# EAGLE design shield (EAGLE 6.6.0)
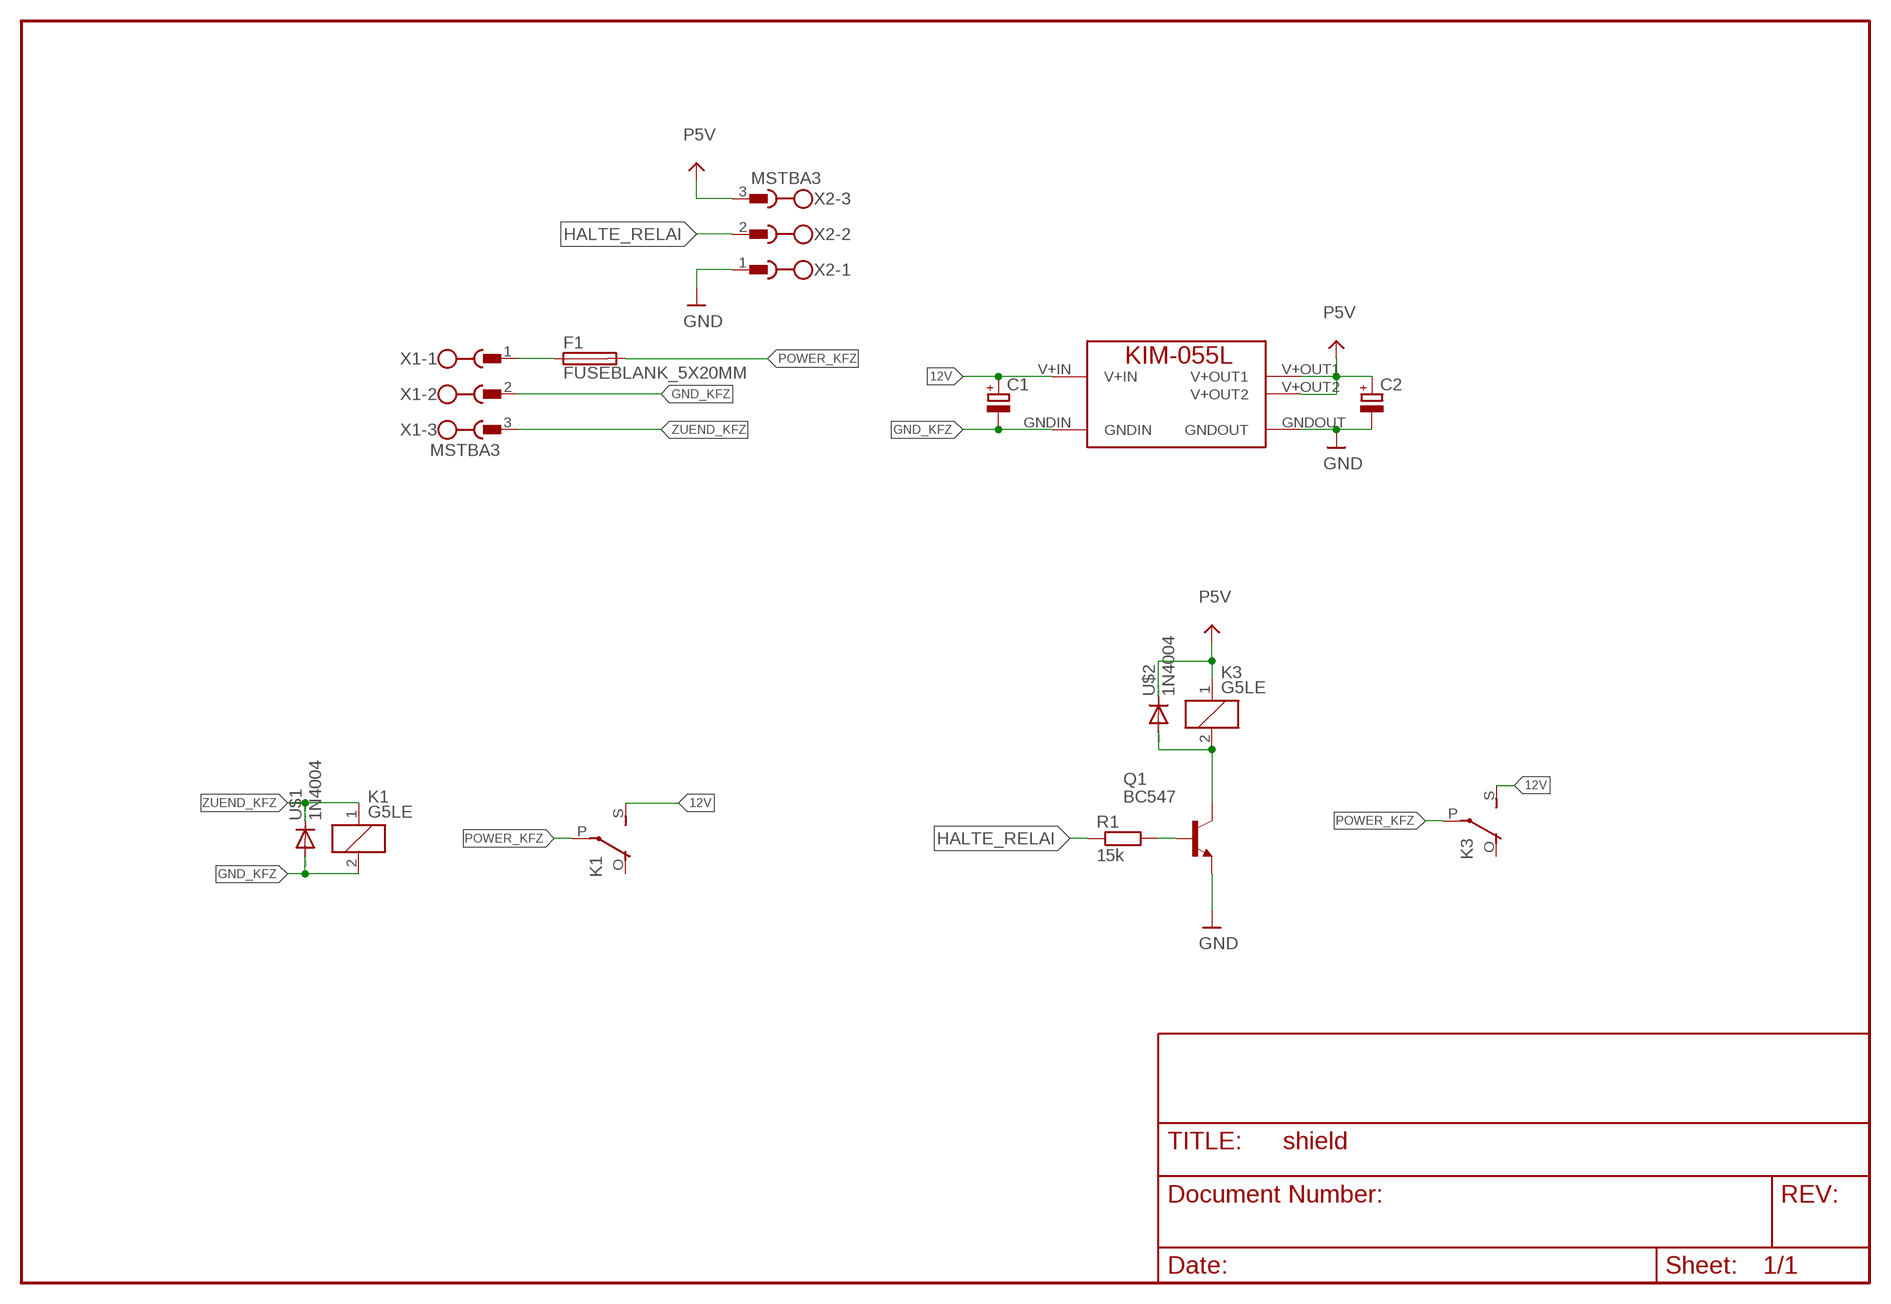
[diagram p0: schematic, sheet 1]

## Parts
C1  CPOL-EUE5-13  [E5-13]
C2  CPOL-EUE5-13  [E5-13]
F1  FUSEBLANK_5X20MM  [FUSE_HOLDER_5X20MM]
K1  G5LE  [G5LE]
K3  G5LE  [G5LE]
MOD1  KIM-055L  [KIM-055L]
Q1  BC547  [TO92]
R1  15k  R-EU_0207/7  [0207/7]
U$1  1N4004  [DO41-10]
U$2  1N4004  [DO41-10]
X1  MSTBA3  [MSTBA3]
X2  MSTBA3  [MSTBA3]

## Nets
12V: C1.+ K1.S(2:S) K3.S(2:S) MOD1.V+IN
GND: C2.- MOD1.GNDOUT Q1.1(E) X2.1
GND_KFZ: C1.- K1.2 MOD1.GNDIN U$1.A X1.2
HALTE_RELAI: R1.1 X2.2
N$1: K3.2 Q1.3(C) U$2.A
N$2: Q1.2(B) R1.2
N$3: F1.1 X1.1
P5V: C2.+ K3.1 MOD1.V+OUT1 MOD1.V+OUT2 U$2.C X2.3
POWER_KFZ: F1.2 K1.P(2:P) K3.P(2:P)
ZUEND_KFZ: K1.1 U$1.C X1.3
Unconnected: K1.O(2:O) K3.O(2:O)

## Library data of the parts
C1 C2 = schlager_passiv:CPOL-EU: POLARIZED CAPACITOR, European symbol
F1 = fuse:FUSE: Fuse; OC_FARNELL: unknown; OC_NEWARK: unknown
K1 K3 = relay:G5LE: RELAY 1 x switch, 10 A/120 V AC, 8 A/30 V DC, Omron; OC_FARNELL: unknown; OC_NEWARK: unknown
MOD1 = kim055l:KIM-055L: 5V 5amp DC DC module. IMPORANT: Add low ESR input & output capacitors. V+OUT1 & V+OUT2 internally connected.
Q1 = transistor-npn:BC547*: NPN Transistor
R1 = schlager_passiv:R-EU_: RESISTOR, European symbol
U$1 U$2 = diode:1N4004: DIODE general purpose rectifier, 1 A
X1 X2 = X_Phoenix:MSTBA3: PHOENIX

## Board
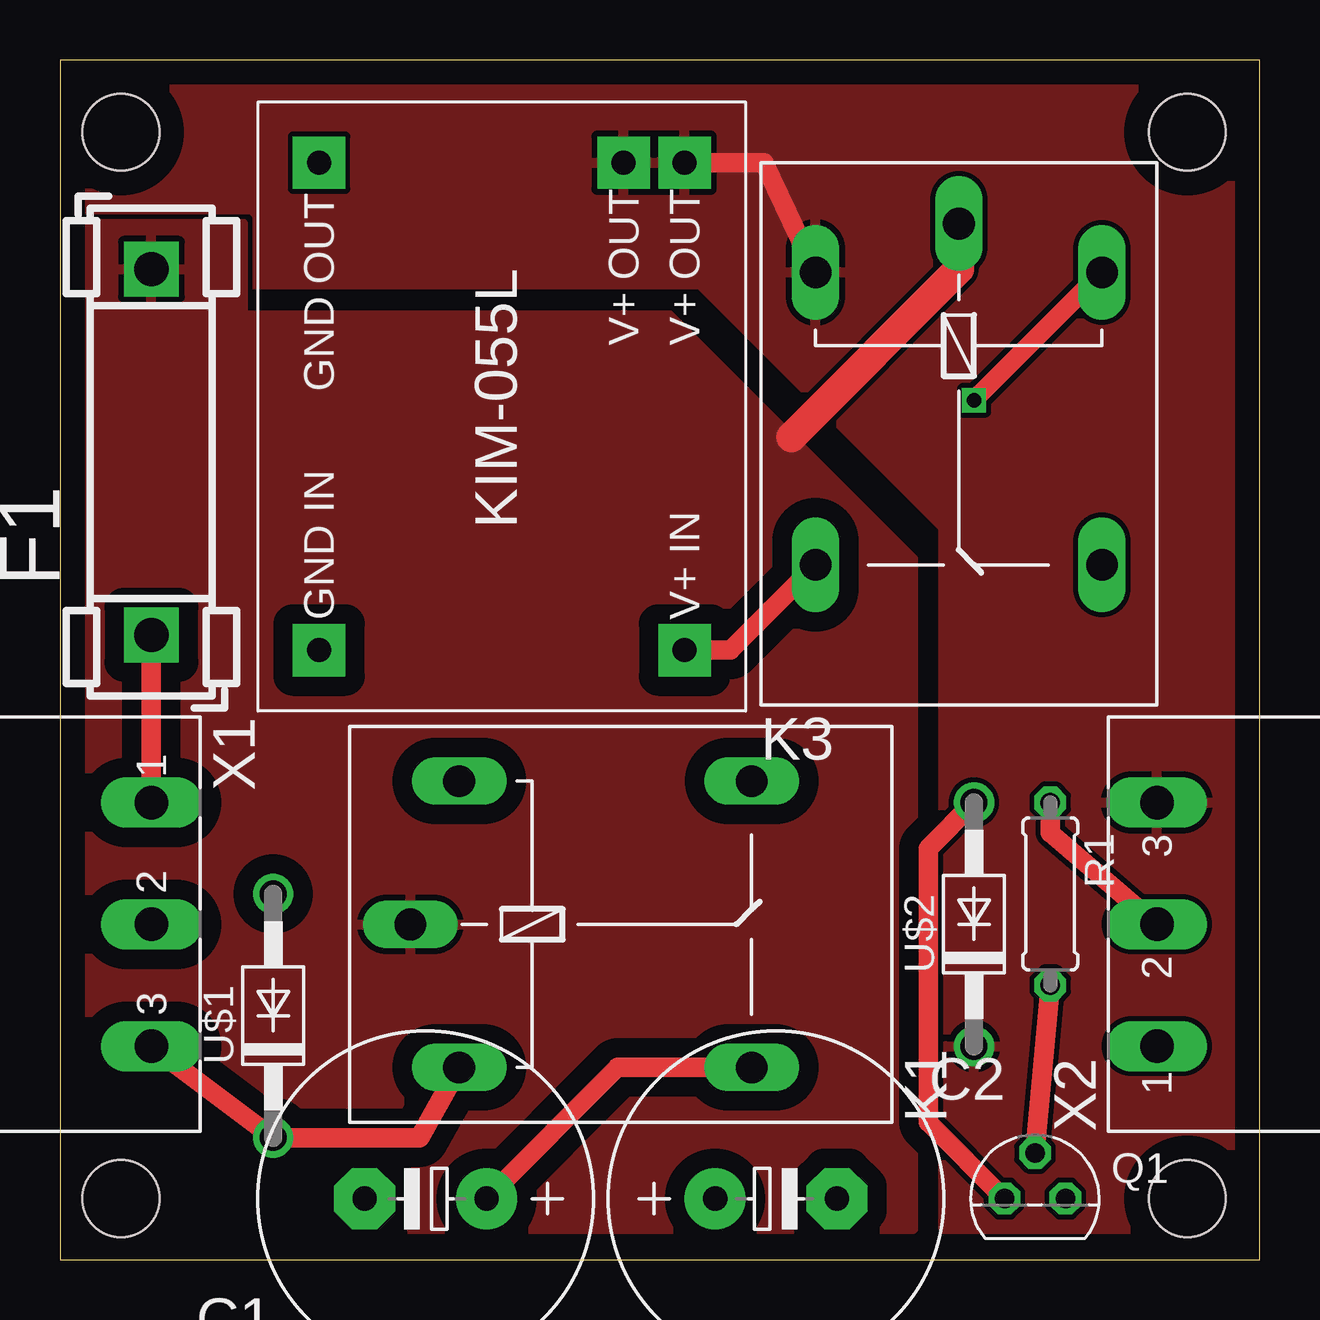
[diagram p1: board, top side]
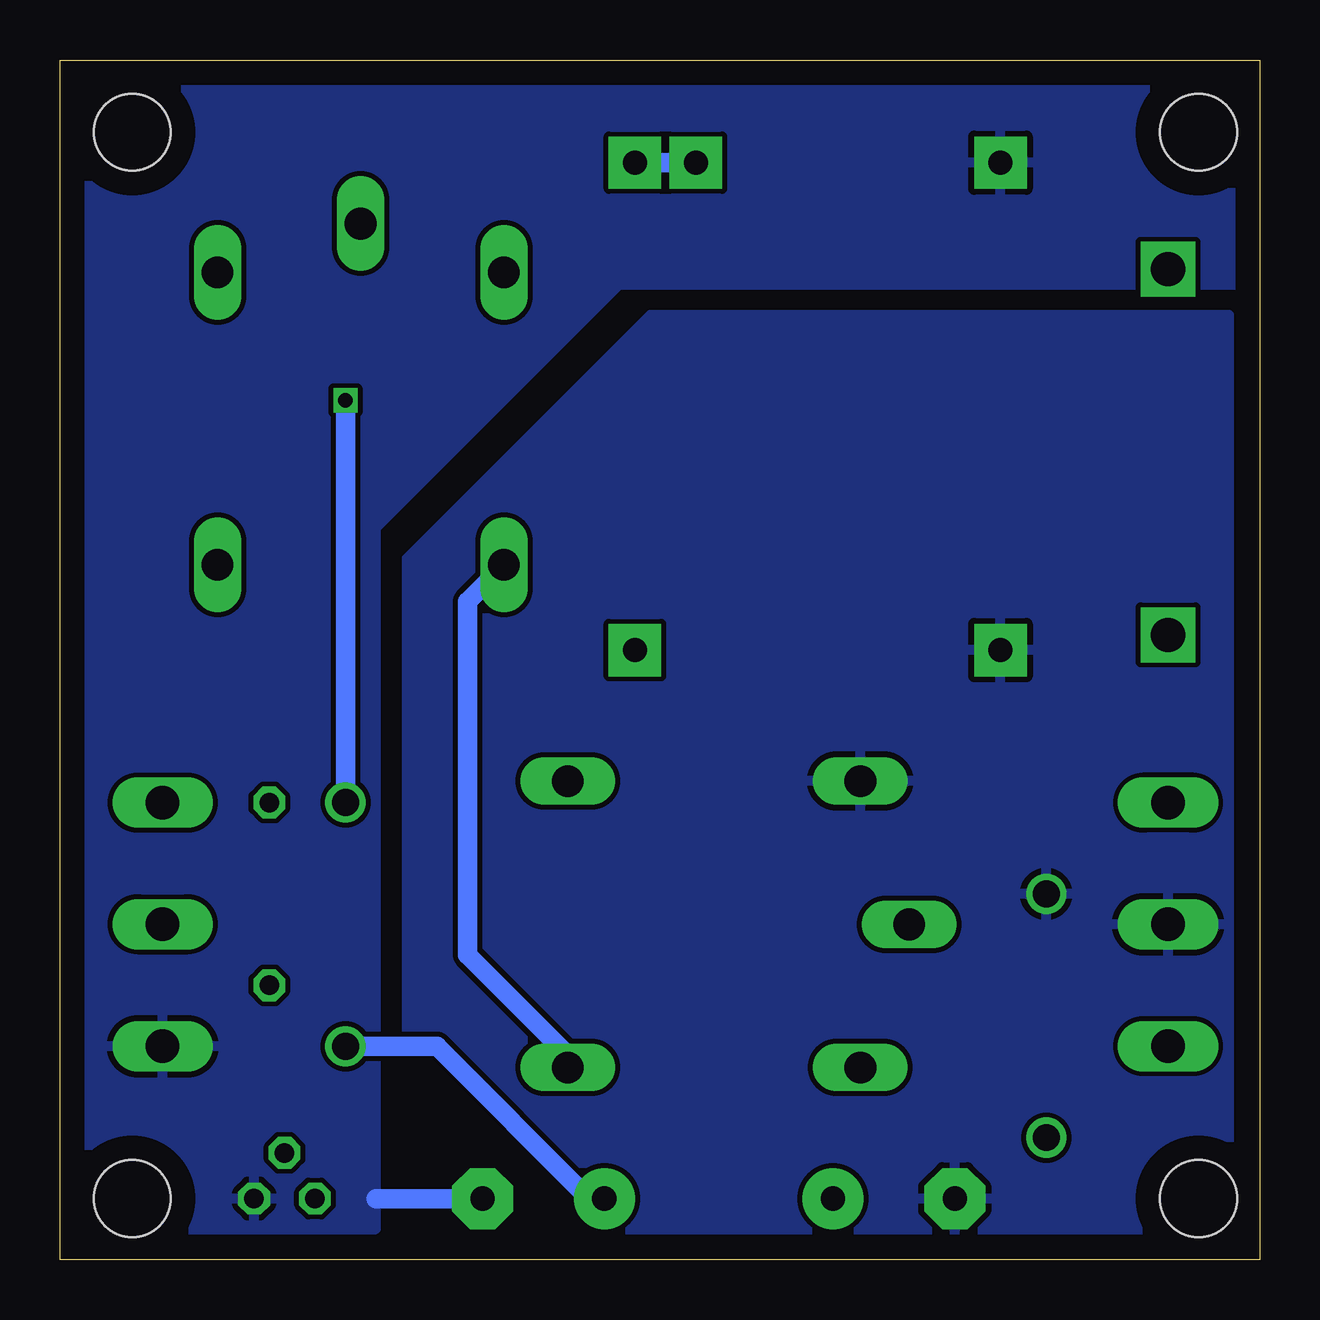
[diagram p2: board, bottom side, seen from below]

Size 50 x 50 mm. Coordinates in mm from the lower left corner, seen from the top.
Outline: 0,0 50,0 50,50 0,50 0,0
Copper layers (1*16): Top 0.035mm / dielectric 1.5mm / Bottom 0.035mm
Design rules "default": minimum track width 10mil, minimum drill 24mil, track to track 8mil, track to pad 8mil, pad to pad 8mil, via to via 8mil, smd to smd 8mil, copper to edge 40mil, drill to drill 8mil, minimum pad ring 10mil, minimum via ring 8mil, stop-mask expansion 4mil, vias tented up to drill 0mil, thermal gap 10mil
Holes 3.2 mm at 2.54,2.54 46.99,2.54 46.99,46.99 2.54,46.99

### Footprints (pad centres in the part's own frame; a part is rotated, then mirrored left to right if it is on the bottom)
E5-13 = drill 1.016 pad 2.54: + -2.54,0 | drill 1.016 pad 2.54 octagon: - 2.54,0
FUSE_HOLDER_5X20MM = drill 1.422 pad 2.286 square: 1 0,0; 2 15.24,0
G5LE = drill 1.321 long: 1 -7.493,-5.969; 2 -7.493,5.969; O 4.699,5.969; P -9.525,0; S 4.699,-5.969
KIM-055L = drill 1 pad 2.184 square: GNDIN -10.16,7.62; GNDOUT 10.16,7.62; V+IN -10.16,-7.62; V+OUT1 10.16,-5.08; V+OUT2 10.16,-7.62
TO92 = drill 0.813 octagon: 1 1.27,0; 2 0,1.905; 3 -1.27,0
0207/7 = drill 0.813 octagon: 1 -3.81,0; 2 3.81,0
DO41-10 = drill 1.118: A 5.08,0; C -5.08,0
MSTBA3 = drill 1.397 long: 1 -5.08,5.08; 2 0,5.08; 3 5.08,5.08

### Placement (x,y rotation side)
C1  15.24,2.54 180 top
C2  29.84,2.54 0 top
F1  3.81,26.04 90 top
K1  24.13,13.97 0 top
K3  37.47,33.66 270 top
MOD1  18.41,35.56 90 top
Q1  40.64,2.54 0 top
R1  41.27,15.24 270 top
U$1  8.89,10.16 90 top
U$2  38.1,13.97 90 top
X1  -1.27,13.97 270 top
X2  50.8,13.97 90 top

### Tracks (layer width: path | path; a pad name or v marks a point on that pad's centre or on a via)
12V
  Top 0.813: K3.S 27.94,25.4 MOD1.V+IN | K1.S 23.24,8 C1.+
  Bottom 0.813: K1.S 28.83,8.51 33.02,12.7 33.02,27.43 K3.S
GND
  Bottom 0.813: C2.- 36.83,2.54
  pour Bottom: 0,49.53 49.53,49.53 49.53,1.27 36.83,1.27 36.83,30.48 26.67,40.64 0,40.64
GND_KFZ
  pour Bottom: 1.27,39.37 25.4,39.37 35.56,29.21 35.56,1.27 1.27,1.27
HALTE_RELAI
  Top 0.813: X2.2 41.27,17.78 R1.1
N$1  (via drill 0.6)
  Top 0.813: Q1.3 36.2,5.71 36.2,17.14 U$2.A | v38.1,35.81 K3.2
  Bottom 0.813: U$2.A v38.1,35.81
N$2
  Top 0.813: R1.2 Q1.2
N$3
  Top 0.813: X1.1 F1.1
P5V
  Top 0.813: MOD1.V+OUT2 29.34,45.72 K3.1
  Bottom 0.813: MOD1.V+OUT2 MOD1.V+OUT1 | C2.+ 27.94,2.54 34.29,8.89 U$2.C
  pour Top (rank 6): 0,49.53 49.53,49.53 49.53,1.27 36.83,1.27 36.83,30.48 26.67,40.64 0,40.64
POWER_KFZ
  Top 1.27: K3.P 37.47,41.27 30.48,34.29
  pour Top (isolate 0.813, rank 3): 1.27,1.27 1.27,43.18 7.62,43.18 7.62,39.37 25.4,39.37 35.56,29.21 35.56,1.27
ZUEND_KFZ
  Top 0.813: K1.1 14.99,5.08 U$1.C X1.3